# Altium schematic sheet FPGA_PWR.SchDoc
size A3
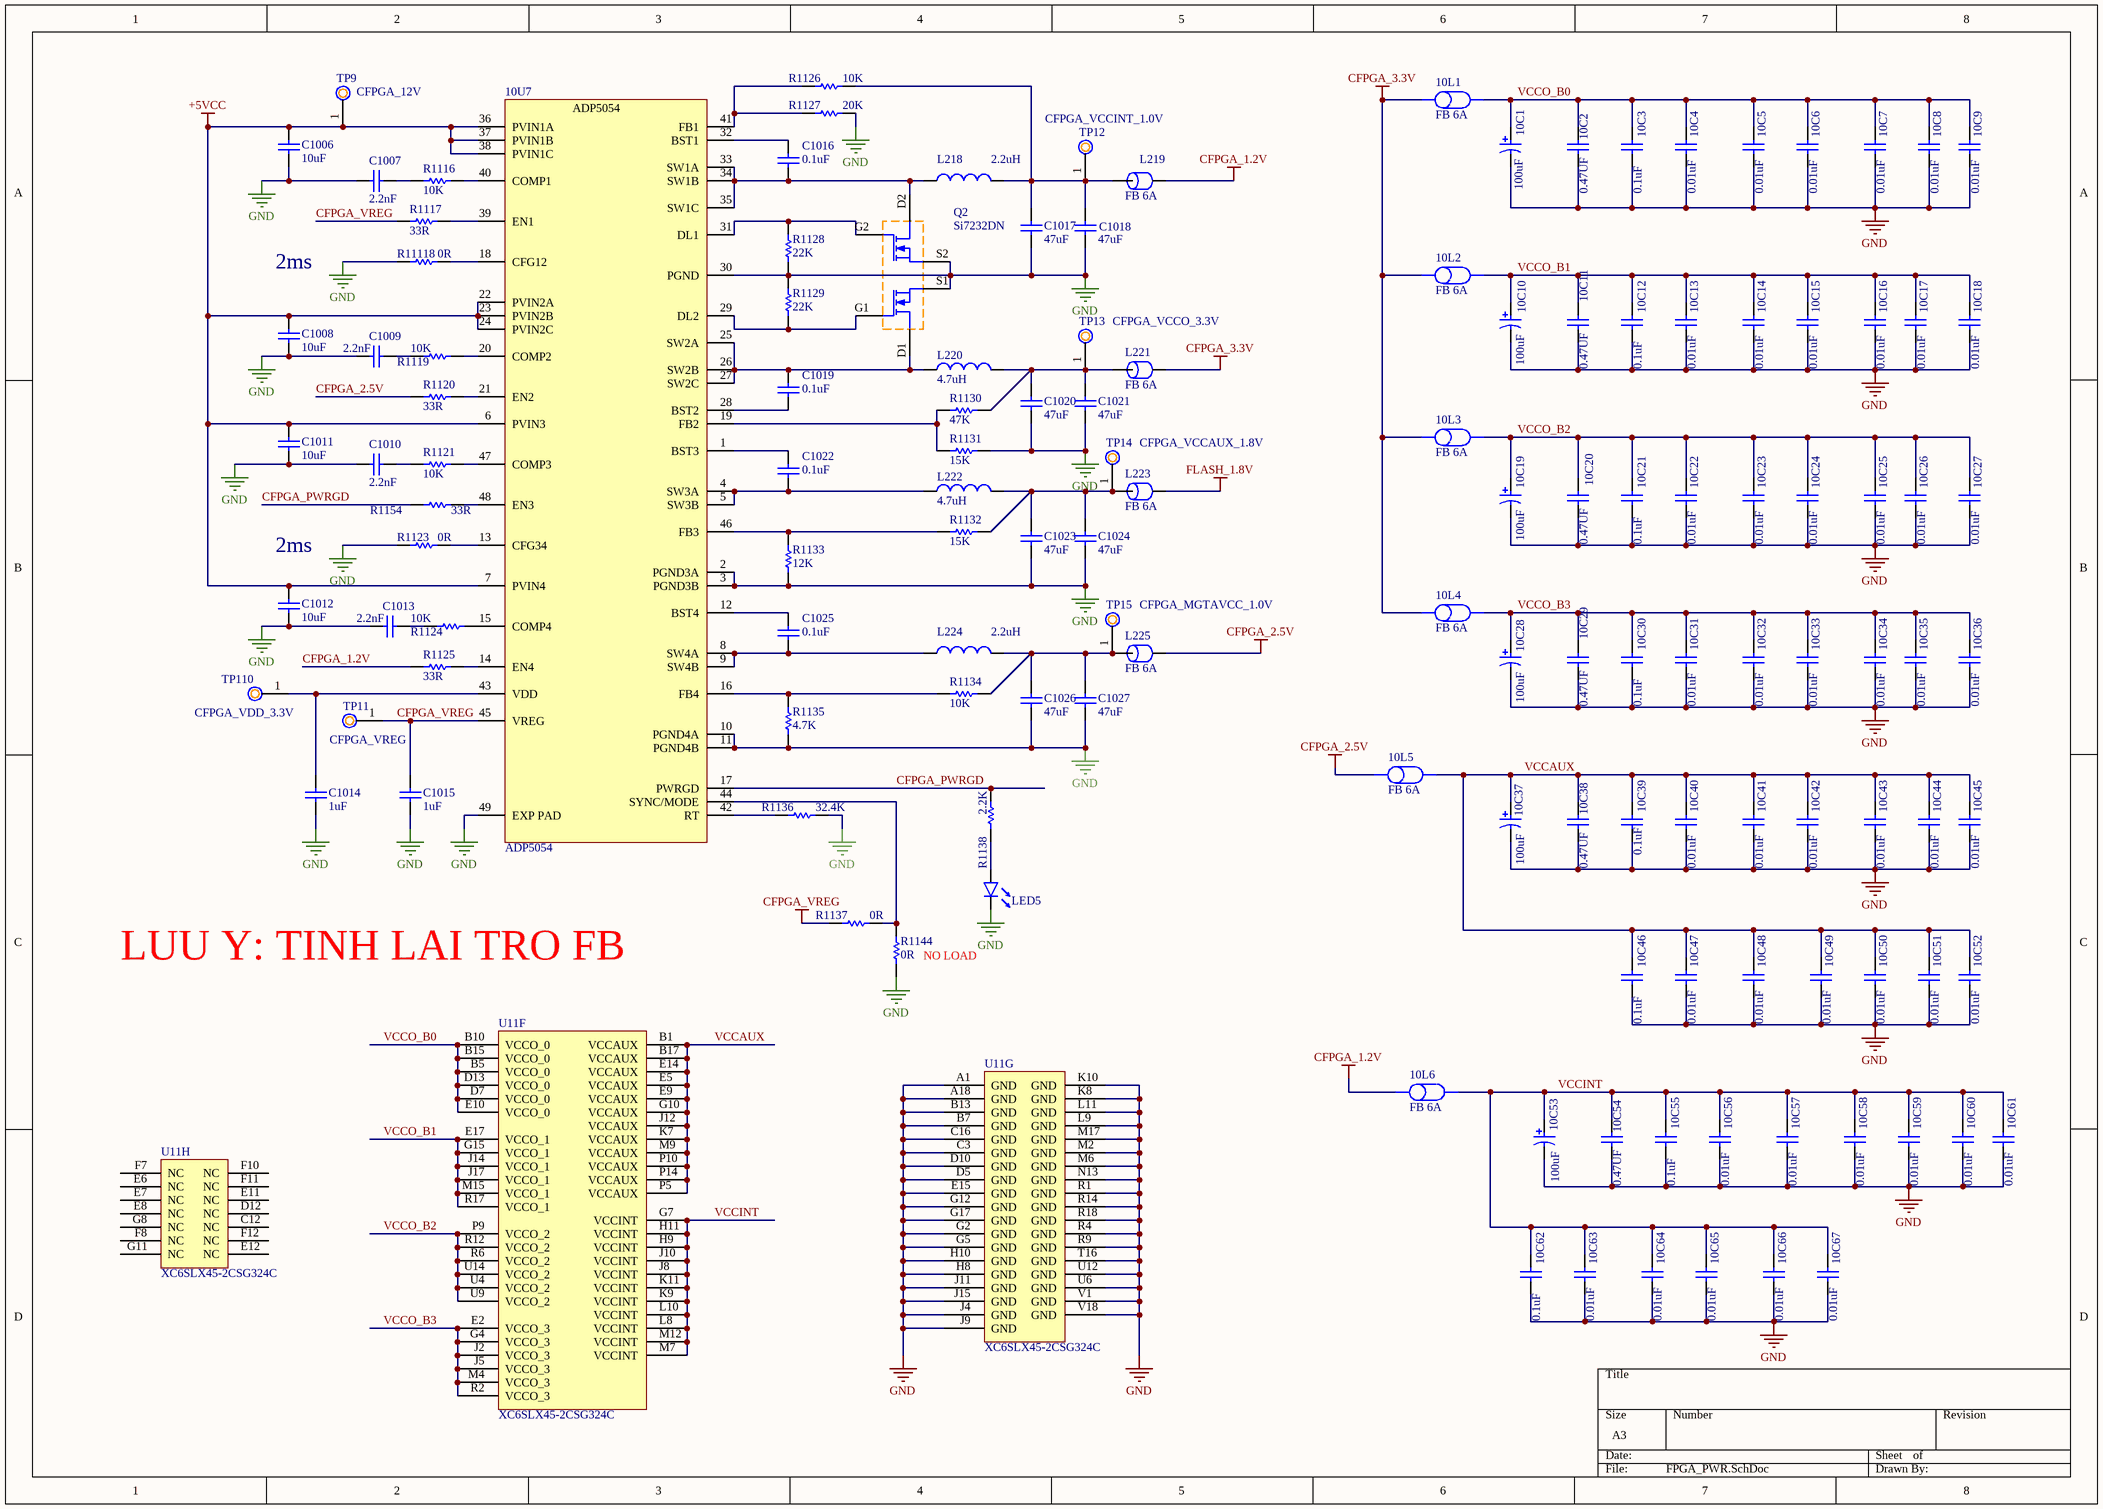
[diagram p0: FPGA_PWR.SchDoc]

## Parts
10C1  100uF  [C1206 - P]
10C2  0.47UF  [C0402_1]
10C3  0.1uF  [C0402_1]
10C4  0.01uF  [C0402]
10C5  0.01uF  [C0402]
10C6  0.01uF  [C0402]
10C7  0.01uF  [C0402]
10C8  0.01uF  [C0402]
10C9  0.01uF  [C0402]
10C10  100uF  [C1206 - P]
10C11  0.47UF  [C0402_1]
10C12  0.1uF  [C0402_1]
10C13  0.01uF  [C0402]
10C14  0.01uF  [C0402]
10C15  0.01uF  [C0402]
10C16  0.01uF  [C0402]
10C17  0.01uF  [C0402]
10C18  0.01uF  [C0402]
10C19  100uF  [C1206 - P]
10C20  0.47UF  [C0402_1]
10C21  0.1uF  [C0402_1]
10C22  0.01uF  [C0402]
10C23  0.01uF  [C0402]
10C24  0.01uF  [C0402]
10C25  0.01uF  [C0402]
10C26  0.01uF  [C0402]
10C27  0.01uF  [C0402]
10C28  100uF  [C1206 - P]
10C29  0.47UF  [C0402_1]
10C30  0.1uF  [C0402_1]
10C31  0.01uF  [C0402]
10C32  0.01uF  [C0402]
10C33  0.01uF  [C0402]
10C34  0.01uF  [C0402]
10C35  0.01uF  [C0402]
10C36  0.01uF  [C0402]
10C37  100uF  [C1206 - P]
10C38  0.47UF  [C0402_1]
10C39  0.1uF  [C0402_1]
10C40  0.01uF  [C0402]
10C41  0.01uF  [C0402]
10C42  0.01uF  [C0402]
10C43  0.01uF  [C0402]
10C44  0.01uF  [C0402]
10C45  0.01uF  [C0402]
10C46  0.1uF  [C0402_1]
10C47  0.01uF  [C0402]
10C48  0.01uF  [C0402]
10C49  0.01uF  [C0402]
10C50  0.01uF  [C0402]
10C51  0.01uF  [C0402]
10C52  0.01uF  [C0402]
10C53  100uF  [C1206 - P]
10C54  0.47UF  [C0402_1]
10C55  0.1uF  [C0402_1]
10C56  0.01uF  [C0402]
10C57  0.01uF  [C0402]
10C58  0.01uF  [C0402]
10C59  0.01uF  [C0402]
10C60  0.01uF  [C0402]
10C61  0.01uF  [C0402]
10C62  0.1uF  [C0402_1]
10C63  0.01uF  [C0402]
10C64  0.01uF  [C0402]
10C65  0.01uF  [C0402]
10C66  0.01uF  [C0402]
10C67  0.01uF  [C0402]
10L1  FB 6A  [0805]
10L2  FB 6A  [0805]
10L3  FB 6A  [0805]
10L4  FB 6A  [0805]
10L5  FB 6A  [0805]
10L6  FB 6A  [0805]
10U7  ADP5054  [48-LFCSP]
C1006  10uF  [C0805_1]
C1007  2.2nF  [C0402_1]
C1008  10uF  [C0805_1]
C1009  2.2nF  [C0402_1]
C1010  2.2nF  [C0402_1]
C1011  10uF  [C0805_1]
C1012  10uF  [C0805_1]
C1013  2.2nF  [C0402_1]
C1014  1uF  [C0402_1]
C1015  1uF  [C0402_1]
C1016  0.1uF  [C0402_1]
C1017  47uF  [C0805_1]
C1018  47uF  [C0805_1]
C1019  0.1uF  [C0402_1]
C1020  47uF  [C0805_1]
C1021  47uF  [C0805_1]
C1022  0.1uF  [C0402_1]
C1023  47uF  [C0805_1]
C1024  47uF  [C0805_1]
C1025  0.1uF  [C0402_1]
C1026  47uF  [C0805_1]
C1027  47uF  [C0805_1]
L218  2.2uH  [XAL6030-222MEB]
L219  FB 6A  [0805]
L220  4.7uH  [XFL4020-472MEB]
L221  FB 6A  [0805]
L222  4.7uH  [XFL4020-472MEB]
L223  FB 6A  [0805]
L224  2.2uH  [XAL6030-222MEB]
L225  FB 6A  [0805]
LED5  LED GREEN  [LED-0805]  (value not drawn)
Q2  Si7232DN  [PowerPAK 1212-8]
R1116  10K  [0402_1]
R1117  33R  [0402_1]
R1119  10K  [0402_1]
R1120  33R  [0402_1]
R1121  10K  [0402_1]
R1123  0R  [0402_1]
R1124  10K  [0402_1]
R1125  33R  [0402_1]
R1126  10K  [0402_1]
R1127  20K  [0402_1]
R1128  22K  [0402_1]
R1129  22K  [0402_1]
R1130  47K  [0402_1]
R1131  15K  [0402_1]
R1132  15K  [0402_1]
R1133  12K  [0402_1]
R1134  10K  [0402_1]
R1135  4.7K  [0402_1]
R1136  32.4K  [0402_1]
R1137  0R  [0402_1]
R1138  2.2K  [0402_1]
R1144  0R  NO_LOAD: NO LOAD  [0402_1]
R1154  33R  [0402_1]
R11118  0R  [0402_1]
TP9  CFPGA_12V  [TP]
TP11  CFPGA_VREG  [TP]
TP12  CFPGA_VCCINT_1.0V  [TP]
TP13  CFPGA_VCCO_3.3V  [TP]
TP14  CFPGA_VCCAUX_1.8V  [TP]
TP15  CFPGA_MGTAVCC_1.0V  [TP]
TP110  CFPGA_VDD_3.3V  [TP]
U11  XC6SLX45-2CSG324C  [CSG324]  (parts F,G,H of 8)

## Nets
+5VCC: 10U7.6(PVIN3) 10U7.7(PVIN4) 10U7.22(PVIN2A) 10U7.23(PVIN2B) 10U7.24(PVIN2C) 10U7.36(PVIN1A) 10U7.37(PVIN1B) 10U7.38(PVIN1C) C1006.1 C1008.1 C1011.1 C1012.1 TP9.1
CFPGA_1.2V: 10L6.2 L219.2 R1125.1
CFPGA_2.5V: 10L5.2 L225.2 R1120.1
CFPGA_3.3V: 10L1.2 10L2.2 10L3.2 10L4.2 L221.2
CFPGA_VREG: 10U7.45(VREG) C1015.1 R1117.1 R1137.1 TP11.1
FLASH_1.8V: L223.2
GND: 10C1.2 10C2.1 10C3.1 10C4.1 10C5.1 10C6.1 10C7.1 10C8.1 10C9.1 10C10.2 10C11.1 10C12.1 10C13.1 10C14.1 10C15.1 10C16.1 10C17.1 10C18.1 10C19.2 10C20.1 10C21.1 10C22.1 10C23.1 10C24.1 10C25.1 10C26.1 10C27.1 10C28.2 10C29.1 10C30.1 10C31.1 10C32.1 10C33.1 10C34.1 10C35.1 10C36.1 10C37.2 10C38.1 10C39.1 10C40.1 10C41.1 10C42.1 10C43.1 10C44.1 10C45.1 10C46.1 10C47.1 10C48.1 10C49.1 10C50.1 10C51.1 10C52.1 10C53.2 10C54.1 10C55.1 10C56.1 10C57.1 10C58.1 10C59.1 10C60.1 10C61.1 10C62.1 10C63.1 10C64.1 10C65.1 10C66.1 10C67.1 10U7.2(PGND3A) 10U7.3(PGND3B) 10U7.10(PGND4A) 10U7.11(PGND4B) 10U7.30(PGND) 10U7.49(EXP_PAD) C1006.2 C1007.1 C1008.2 C1009.1 C1010.1 C1011.2 C1012.2 C1013.1 C1014.2 C1015.2 C1017.1 C1018.1 C1020.1 C1021.1 C1023.1 C1024.1 C1026.1 C1027.1 LED5.1 Q2.S1 Q2.S2 R1123.1 R1127.1 R1128.2 R1129.1 R1131.2 R1133.1 R1135.1 R1136.2 R1144.2 R11118.1 U11.A1(GND) U11.A18(GND) U11.B7(GND) U11.B13(GND) U11.C3(GND) U11.C16(GND) U11.D5(GND) U11.D10(GND) U11.E15(GND) U11.G2(GND) U11.G5(GND) U11.G12(GND) U11.G17(GND) U11.H8(GND) U11.H10(GND) U11.J4(GND) U11.J9(GND) U11.J11(GND) U11.J15(GND) U11.K8(GND) U11.K10(GND) U11.L9(GND) U11.L11(GND) U11.M2(GND) U11.M6(GND) U11.M17(GND) U11.N13(GND) U11.R1(GND) U11.R4(GND) U11.R9(GND) U11.R14(GND) U11.R18(GND) U11.T16(GND) U11.U6(GND) U11.U12(GND) U11.V1(GND) U11.V18(GND)
CFPGA_PWRGD: 10U7.17(PWRGD) R1138.2 R1154.1
VCCAUX: 10C37.1 10C38.2 10C39.2 10C40.2 10C41.2 10C42.2 10C43.2 10C44.2 10C45.2 10C46.2 10C47.2 10C48.2 10C49.2 10C50.2 10C51.2 10C52.2 10L5.1 U11.B1(VCCAUX) U11.B17(VCCAUX) U11.E5(VCCAUX) U11.E9(VCCAUX) U11.E14(VCCAUX) U11.G10(VCCAUX) U11.J12(VCCAUX) U11.K7(VCCAUX) U11.M9(VCCAUX) U11.P5(VCCAUX) U11.P10(VCCAUX) U11.P14(VCCAUX)
VCCINT: 10C53.1 10C54.2 10C55.2 10C56.2 10C57.2 10C58.2 10C59.2 10C60.2 10C61.2 10C62.2 10C63.2 10C64.2 10C65.2 10C66.2 10C67.2 10L6.1 U11.G7(VCCINT) U11.H9(VCCINT) U11.H11(VCCINT) U11.J8(VCCINT) U11.J10(VCCINT) U11.K9(VCCINT) U11.K11(VCCINT) U11.L8(VCCINT) U11.L10(VCCINT) U11.M7(VCCINT) U11.M12(VCCINT)
VCCO_B0: 10C1.1 10C2.2 10C3.2 10C4.2 10C5.2 10C6.2 10C7.2 10C8.2 10C9.2 10L1.1 U11.B5(VCCO_0) U11.B10(VCCO_0) U11.B15(VCCO_0) U11.D7(VCCO_0) U11.D13(VCCO_0) U11.E10(VCCO_0)
VCCO_B1: 10C10.1 10C11.2 10C12.2 10C13.2 10C14.2 10C15.2 10C16.2 10C17.2 10C18.2 10L2.1 U11.E17(VCCO_1) U11.G15(VCCO_1) U11.J14(VCCO_1) U11.J17(VCCO_1) U11.M15(VCCO_1) U11.R17(VCCO_1)
VCCO_B2: 10C19.1 10C20.2 10C21.2 10C22.2 10C23.2 10C24.2 10C25.2 10C26.2 10C27.2 10L3.1 U11.P9(VCCO_2) U11.R6(VCCO_2) U11.R12(VCCO_2) U11.U4(VCCO_2) U11.U9(VCCO_2) U11.U14(VCCO_2)
VCCO_B3: 10C28.1 10C29.2 10C30.2 10C31.2 10C32.2 10C33.2 10C34.2 10C35.2 10C36.2 10L4.1 U11.E2(VCCO_3) U11.G4(VCCO_3) U11.J2(VCCO_3) U11.J5(VCCO_3) U11.M4(VCCO_3) U11.R2(VCCO_3)
Net10U7_1: 10U7.1(BST3) C1022.1
Net10U7_4: 10U7.4(SW3A) 10U7.5(SW3B) C1022.2 L222.1
Net10U7_8: 10U7.8(SW4A) 10U7.9(SW4B) C1025.2 L224.1
Net10U7_12: 10U7.12(BST4) C1025.1
Net10U7_13: 10U7.13(CFG34) R1123.2
Net10U7_14: 10U7.14(EN4) R1125.2
Net10U7_15: 10U7.15(COMP4) R1124.2
Net10U7_16: 10U7.16(FB4) R1134.2 R1135.2
Net10U7_18: 10U7.18(CFG12) R11118.2
Net10U7_19: 10U7.19(FB2) R1130.1 R1131.1
Net10U7_20: 10U7.20(COMP2) R1119.2
Net10U7_21: 10U7.21(EN2) R1120.2
Net10U7_25: 10U7.25(SW2A) 10U7.26(SW2B) 10U7.27(SW2C) C1019.1 L220.1 Q2.D1
Net10U7_28: 10U7.28(BST2) C1019.2
Net10U7_29: 10U7.29(DL2) Q2.G1 R1129.2
Net10U7_31: 10U7.31(DL1) Q2.G2 R1128.1
Net10U7_32: 10U7.32(BST1) C1016.1
Net10U7_33: 10U7.33(SW1A) 10U7.34(SW1B) 10U7.35(SW1C) C1016.2 L218.1 Q2.D2
Net10U7_39: 10U7.39(EN1) R1117.2
Net10U7_40: 10U7.40(COMP1) R1116.2
Net10U7_41: 10U7.41(FB1) R1126.2 R1127.2
Net10U7_42: 10U7.42(RT) R1136.1
Net10U7_43: 10U7.43(VDD) C1014.1 TP110.1
Net10U7_44: 10U7.44(SYNC/MODE) R1137.2 R1144.1
Net10U7_46: 10U7.46(FB3) R1132.1 R1133.2
Net10U7_47: 10U7.47(COMP3) R1121.2
Net10U7_48: 10U7.48(EN3) R1154.2
NetC1007_2: C1007.2 R1116.1
NetC1009_2: C1009.2 R1119.1
NetC1010_2: C1010.2 R1121.1
NetC1013_2: C1013.2 R1124.1
NetC1017_2: C1017.2 C1018.2 L218.2 L219.1 R1126.1 TP12.1
NetC1020_2: C1020.2 C1021.2 L220.2 L221.1 R1130.2 TP13.1
NetC1023_2: C1023.2 C1024.2 L222.2 L223.1 R1132.2 TP14.1
NetC1026_2: C1026.2 C1027.2 L224.2 L225.1 R1134.1 TP15.1
NetLED5_2: LED5.2 R1138.1

Not connected (* = marked no-connect by the designer): U11 C12(NC) D12(NC) E6(NC) E7(NC) E8(NC) E11(NC) E12(NC) F7(NC) F8(NC) F10(NC) F11(NC) F12(NC) G8(NC) G11(NC)

## Notes on the sheet
- 2ms
- (near C1012) 2ms
- LUU Y: TINH LAI TRO FB

## Library data of the parts
10C1 10C10 10C19 10C28 10C37 10C53 = TCTAL0J107M8R: CAP TANT 100UF 6.3V 20% 1206; MANUFACTURE: Assembly House; NO_LOAD: LOAD; PART_NUMBER: TCTAL0J107M8R
10C2 10C11 10C20 10C29 10C38 10C54 = Cap Semi: CAP CER .47UF 6.3V 10% X5R 0402; PART_NUMBER: GRM155R60J474KE19D; MANUFACTURE: Assembly House; NO_LOAD: LOAD
10C3 10C12 10C21 10C30 10C39 10C46 10C55 10C62 = Cap Semi: CAP CER .1UF 10V 10% X5R 0402; PART_NUMBER: GRM155R61A104KA01D; MANUFACTURE: Assembly House; NO_LOAD: LOAD
10C4-10C9 10C13-10C18 10C22-10C27 10C31-10C36 10C40-10C45 10C47-10C52 10C56-10C61 10C63-10C67 = Cap Semi: CAP CER 10000PF 6.3V 10% X5R 0402; PART_NUMBER: CL03A103KQ3NNNC; MANUFACTURE: Samsung Electro-Mechanics; NO_LOAD: LOAD
10L1-10L6 = FB: FERRITE BEAD 22 OHM 0805 1LN; PART_NUMBER: BLM21PG220SN1D; MANUFACTURE: Assembly House; NO_LOAD: LOAD
10U7 = ADP5054: IC REG CTRLR BUCK 48LFCSP; MANUFACTURE: Analog Devices Inc; PART_NUMBER: ADP5054ACPZ-R7; NO_LOAD: LOAD
C1006 C1008 C1011 C1012 = CAP_2: CAP CER 10UF 10V 10% X5R 0805; MANUFACTURE: Murata Electronics North America; PART_NUMBER: GRM21BR61A106KE19L; NO_LOAD: LOAD
C1007 C1009 C1010 C1013 = Cap_6: CAP CER 2200PF 10V X5R 0201; MANUFACTURE: Assembly House; PART_NUMBER: GRM033R61A222KA01D; NO_LOAD: LOAD
C1014 C1015 = CAP_2: CAP CER 1UF 10V X5R 0402; MANUFACTURE: Murata Electronics North America; PART_NUMBER: GRM153R61A105ME95D; NO_LOAD: LOAD
C1016 C1019 C1022 C1025 = Cap_6: CAP CER .1UF 10V 10% X5R 0402; MANUFACTURE: Assembly House; PART_NUMBER: GRM155R61A104KA01D; NO_LOAD: LOAD
C1017 C1018 C1020 C1021 C1023 C1024 C1026 C1027 = CAP_1: CAP CER 47UF 6.3V X5R 0805; MANUFACTURE: Assembly House; PART_NUMBER: GRM21BR60J476ME15K; NO_LOAD: LOAD
L218 L224 = IHLP1212BZER1R0M11: Fixed Inductors 2.2uH 20% 10A 13.97mOhms AEC-Q200; MANUFACTURE: Coilcraft; NO_LOAD: LOAD; PART_NUMBER: XAL6030-222MEB
L219 L221 L223 L225 = FERRITE BEAD: FERRITE BEAD 22 OHM 0805 1LN; PART_NUMBER: BLM21PG220SN1D; MANUFACTURE: Assembly House; NO_LOAD: LOAD
L220 L222 = IHLP1212BZER1R0M11: Fixed Inductors 4.7uH 20% 5A 57.4mOhms AEC-Q200; MANUFACTURE: Coilcraft; NO_LOAD: LOAD; PART_NUMBER: XFL4020-472MEB
LED5 = LED: LED GREEN CLEAR 0805 SMD; MANUFACTURE: Lite-On Inc; PART_NUMBER: LTST-C171GKT; NO_LOAD: LOAD
Q2 = Si7232DN: MOSFET 2N-CH 20V 25A PPAK 1212-8; MANUFACTURE: Vishay Siliconix; PART_NUMBER: SI7232DN-T1-GE3; NO_LOAD: LOAD
R1116 R1119 R1121 R1124 = Res1: RES 10K OHM 1% 1/10W 0402; PART_NUMBER: ERJ-2RKF1002X; MANUFACTURE: Panasonic Electronic Components; NO_LOAD: LOAD
R1117 R1120 R1125 R1154 = RES1: RES 33 OHM 5% 1/16W 0402; PART_NUMBER: RC0402JR-0733RL; MANUFACTURE: Assembly House; NO_LOAD: LOAD
R1123 R1137 R11118 = Res1_1: RES 0.0 OHM 1/16W 0402 SMD; PART_NUMBER: RC0402JR-070RL; MANUFACTURE: Assembly House; NO_LOAD: LOAD
R1126 R1134 = Res1: RES SMD 10K OHM 1% 1/10W 0402; PART_NUMBER: ERJ-2RKF1202X; MANUFACTURE: Panasonic Electronic Components; NO_LOAD: LOAD
R1127 = Res1_1: RES SMD 20K OHM 1% 1/10W 0402; PART_NUMBER: ERJ-2GEJ473X; MANUFACTURE: Panasonic Electronic Components; NO_LOAD: LOAD
R1128 R1129 = Res1_1: RES SMD 22K OHM 5% 1/10W 0402; PART_NUMBER: ERJ-2GEJ223X; MANUFACTURE: Panasonic Electronic Components; NO_LOAD: LOAD
R1130 = Res1_1: RES SMD 47K OHM 1% 1/10W 0402; PART_NUMBER: ERJ-2GEJ473X; MANUFACTURE: Panasonic Electronic Components; NO_LOAD: LOAD
R1131 R1132 = Res1_1: RES SMD 15K OHM 1% 1/10W 0402; PART_NUMBER: ERJ-2RKF1502X; MANUFACTURE: Panasonic Electronic Components; NO_LOAD: LOAD
R1133 = Res1: RES SMD 12K OHM 1% 1/10W 0402; PART_NUMBER: ERJ-2RKF1202X; MANUFACTURE: Panasonic Electronic Components; NO_LOAD: LOAD
R1135 = Res1_1: RES SMD 4.7K OHM 1% 1/10W 0402; PART_NUMBER: ERJ-2GEJ473X; MANUFACTURE: Panasonic Electronic Components; NO_LOAD: LOAD
R1136 = Res1_1: RES SMD 32.4K OHM 1% 1/10W 0402; PART_NUMBER: ERJ-2RKF3242X; MANUFACTURE: Panasonic Electronic Components; NO_LOAD: LOAD
R1138 = R: RES 2.2K OHM 5% 1/10W 0402; MANUFACTURE: Assembly House; PART_NUMBER: ERJ-2GEJ222X; NO_LOAD: LOAD
R1144 = Res1_1: RES 0.0 OHM 1/16W 0402 SMD; PART_NUMBER: RC0402JR-070RL; MANUFACTURE: Assembly House
TP9 TP11-TP15 TP110 = TP: CONNECT 1
U11 = XC6SLX45-2CSG324C: Spartan-6 LX 1.2V FPGA, 218 User I/Os, 324-Ball Chip-Scale BGA (0.8mm Pitch), Speed Grade 2, Commercial Grade, Pb-Free; Published: 17-Nov-2009; DatasheetVersion: ver1.6, Nov-2010; PackageVersion: ver1.1, Nov-2009; PackageReference: CSG324; Publisher: Altium Limited; PackageDescription: 324-Ball Chip-Scale BGA (CSG324) Package, 0.8 mm Pitch; Supplier 1: Farnell; Supplier Part Number 1: 1762496; Code_JEDEC: MO-275-KKAC-1; ComponentLink1Description: Manufacturer Link; ComponentLink1URL: http://www.xilinx.com; ComponentLink2Description: Spartan-6 Datasheet; ComponentLink2URL: http://www.xilinx.com/support/documentation/data_sheets/ds160.pdf; ComponentLink3Description: Spartan-6 Documents; ComponentLink3URL: http://www.xilinx.com/support/documentation/spartan-6.htm; ComponentLink4Description: Xilinx.com Home; ComponentLink4URL: http://www.xilinx.com